# EAGLE schematic Module Current Probe (EAGLE 7.2.0)
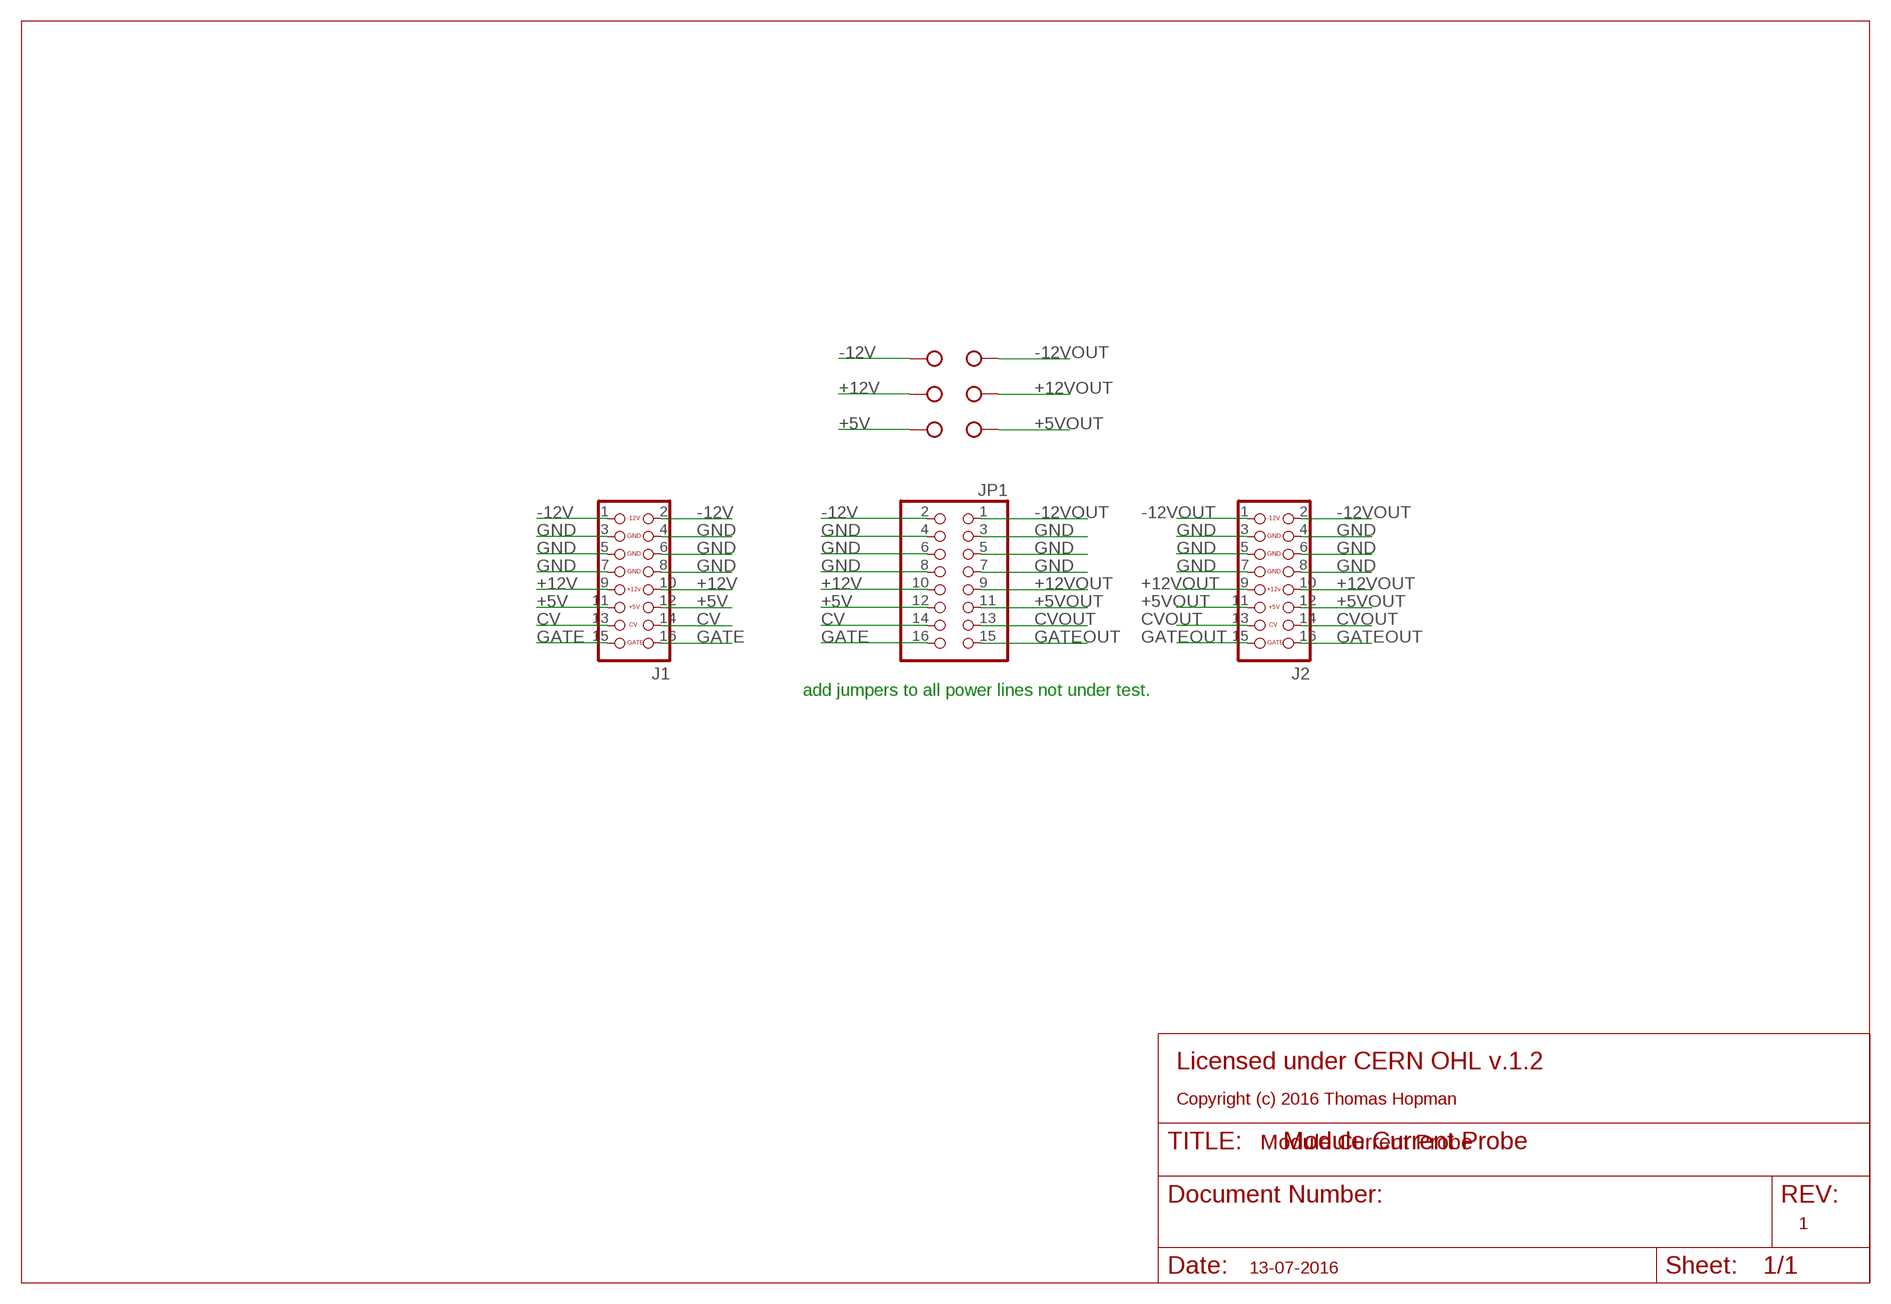
[diagram p0: schematic, sheet 1]

## Parts
J1  CON_HEADER_2X08-PTH-SHROUDED  [PINSHRD_PTH_2X08]
J2  CON_HEADER_2X08-PTH-SHROUDED  [PINSHRD_PTH_2X08]
J3  BANANA-JACK  [BANANA-PRINT]
J4  BANANA-JACK  [BANANA-PRINT]
J5  BANANA-JACK  [BANANA-PRINT]
J6  BANANA-JACK  [BANANA-PRINT]
J7  BANANA-JACK  [BANANA-PRINT]
J8  BANANA-JACK  [BANANA-PRINT]
JP1  PINHD-2X8  [2X08]

## Nets
+5V: J1.11 J1.12 J5.P$1(PIN) JP1.12
+5VOUT: J2.11 J2.12 J8.P$1(PIN) JP1.11
+12V: J1.9 J1.10 J4.P$1(PIN) JP1.10
+12VOUT: J2.9 J2.10 J7.P$1(PIN) JP1.9
-12V: J1.1 J1.2 J3.P$1(PIN) JP1.2
-12VOUT: J2.1 J2.2 J6.P$1(PIN) JP1.1
CV: J1.13 J1.14 JP1.14
CVOUT: J2.13 J2.14 JP1.13
GATE: J1.15 J1.16 JP1.16
GATEOUT: J2.15 J2.16 JP1.15
GND: J1.3 J1.4 J1.5 J1.6 J1.7 J1.8 J2.3 J2.4 J2.5 J2.6 J2.7 J2.8 JP1.3 JP1.4 JP1.5 JP1.6 JP1.7 JP1.8

## Notes on the sheet
- add jumpers to all power lines not under test.
- Licensed under CERN OHL v.1.2
- Copyright (c) 2016 Thomas Hopman
- Module Current Probe
- 1
- 13-07-2016

## Library data of the parts
J1 J2 = tomatek:CON_HEADER_2X08
J3-J8 = con-banana:BANANA-JACK
JP1 = pinhead:PINHD-2X8: PIN HEADER